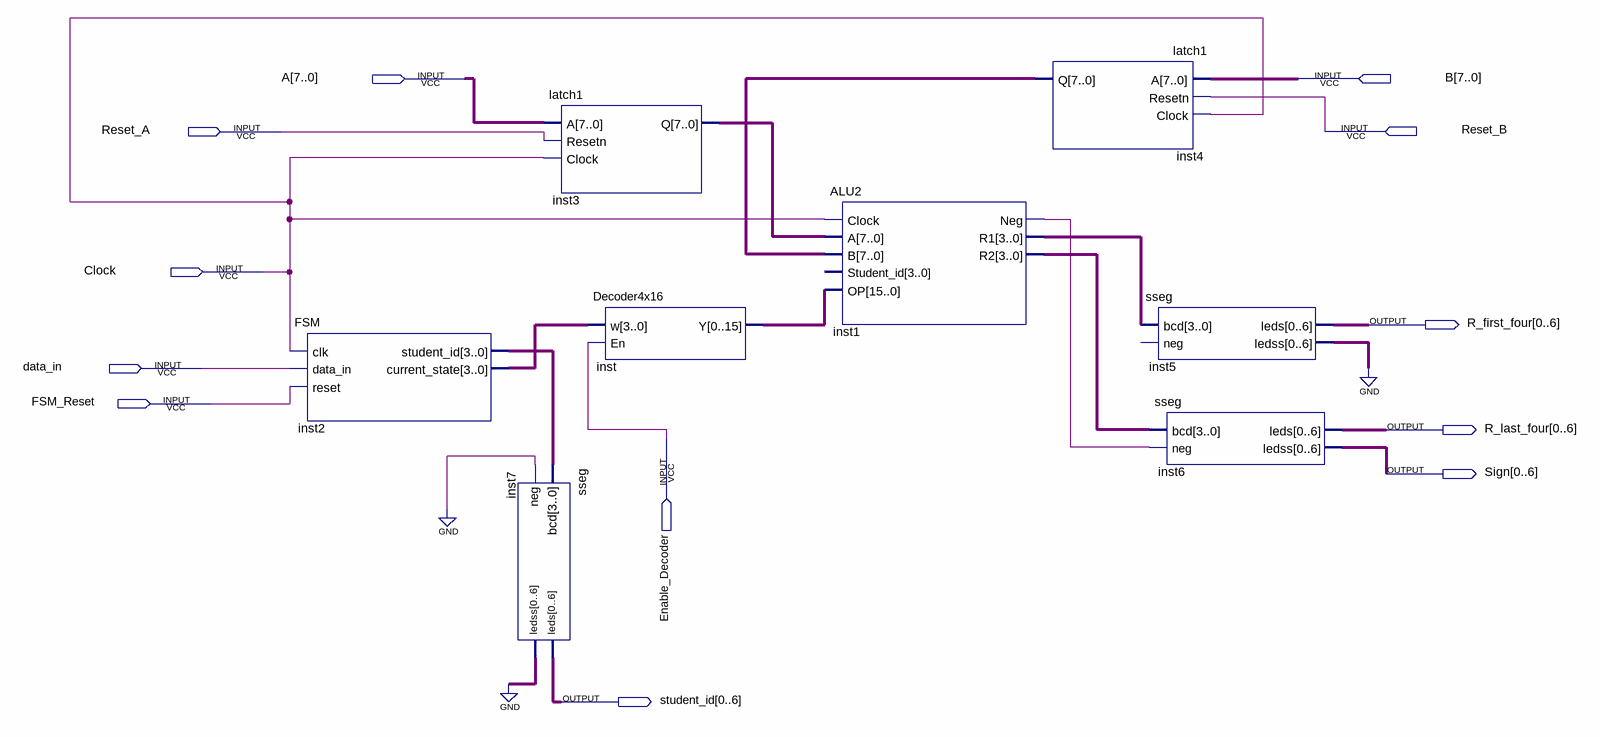
[diagram p0: schematic sheet]
// Quartus schematic ALU2_circuit.bdf as structural Verilog: 8 symbols, 12 pins
module ALU2_circuit (
  input  [7:0] A,
  input  [7:0] B,
  input  Reset_A,
  input  Reset_B,
  input  Clock,
  input  data_in,
  input  FSM_Reset,
  input  Enable_Decoder,
  output [0:6] R_first_four,
  output [0:6] R_last_four,
  output [0:6] Sign,
  output [0:6] student_id
);

  wire inst1_neg;
  wire [3:0] inst1_r1, inst1_r2, inst2_current_state, inst2_student_id;
  wire [6:0] inst5_ledss, inst7_ledss;
  wire [7:0] inst3_q, inst4_q;
  wire [15:0] inst_y;

  FSM inst2 (
    .clk(Clock), .data_in(data_in), .reset(FSM_Reset), .student_id(inst2_student_id),
    .current_state(inst2_current_state));
  sseg inst7 (.bcd(inst2_student_id), .neg(1'b0), .leds(student_id), .ledss(inst7_ledss));
  latch1 inst3 (.A(A), .Resetn(Reset_A), .Clock(Clock), .Q(inst3_q));
  Decoder4x16 inst (.w(inst2_current_state), .En(Enable_Decoder), .Y(inst_y));
  ALU2 inst1 (
    .Clock(Clock), .A(inst3_q), .B(inst4_q), .OP(inst_y), .Neg(inst1_neg), .R1(inst1_r1), .R2(inst1_r2));  // open: Student_id
  latch1 inst4 (.A(B), .Resetn(Reset_B), .Clock(Clock), .Q(inst4_q));
  sseg inst5 (.bcd(inst1_r1), .leds(R_first_four), .ledss(inst5_ledss));  // open: neg
  sseg inst6 (.bcd(inst1_r2), .neg(inst1_neg), .leds(R_last_four), .ledss(Sign));
  // also tied to GND on the sheet: {inst7_ledss[0], inst7_ledss[1], inst7_ledss[2], inst7_ledss[3], inst7_ledss[4], inst7_ledss[5], inst7_ledss[6], inst5_ledss[0], inst5_ledss[1], inst5_ledss[2], inst5_ledss[3], inst5_ledss[4], inst5_ledss[5], inst5_ledss[6]}
endmodule
